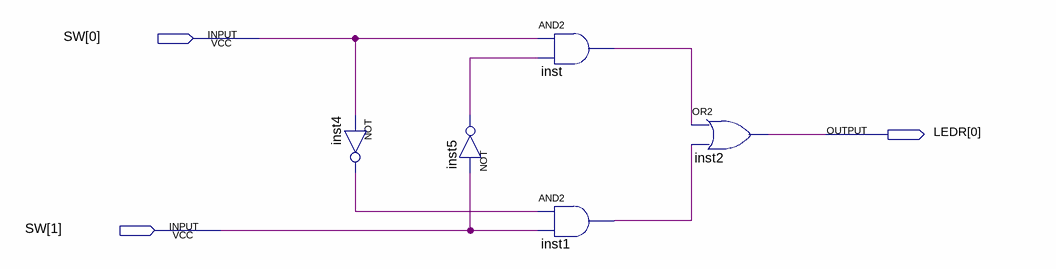
[diagram p0: schematic sheet]
// Quartus schematic light.bdf as structural Verilog: 5 symbols, 3 pins
module light (
  input  [1:0] SW,
  output [0:0] LEDR
);

  wire inst1_out, inst4_out, inst5_out, inst_out;

  not inst4 (inst4_out, SW[0]);
  not inst5 (inst5_out, SW[1]);
  and inst (inst_out, SW[0], inst5_out);
  and inst1 (inst1_out, inst4_out, SW[1]);
  or inst2 (LEDR[0], inst_out, inst1_out);
endmodule
